# Altium schematic sheet bb_optocouplers2.SchDoc
size A4; SheetNumber: 5; SheetTotal: 6
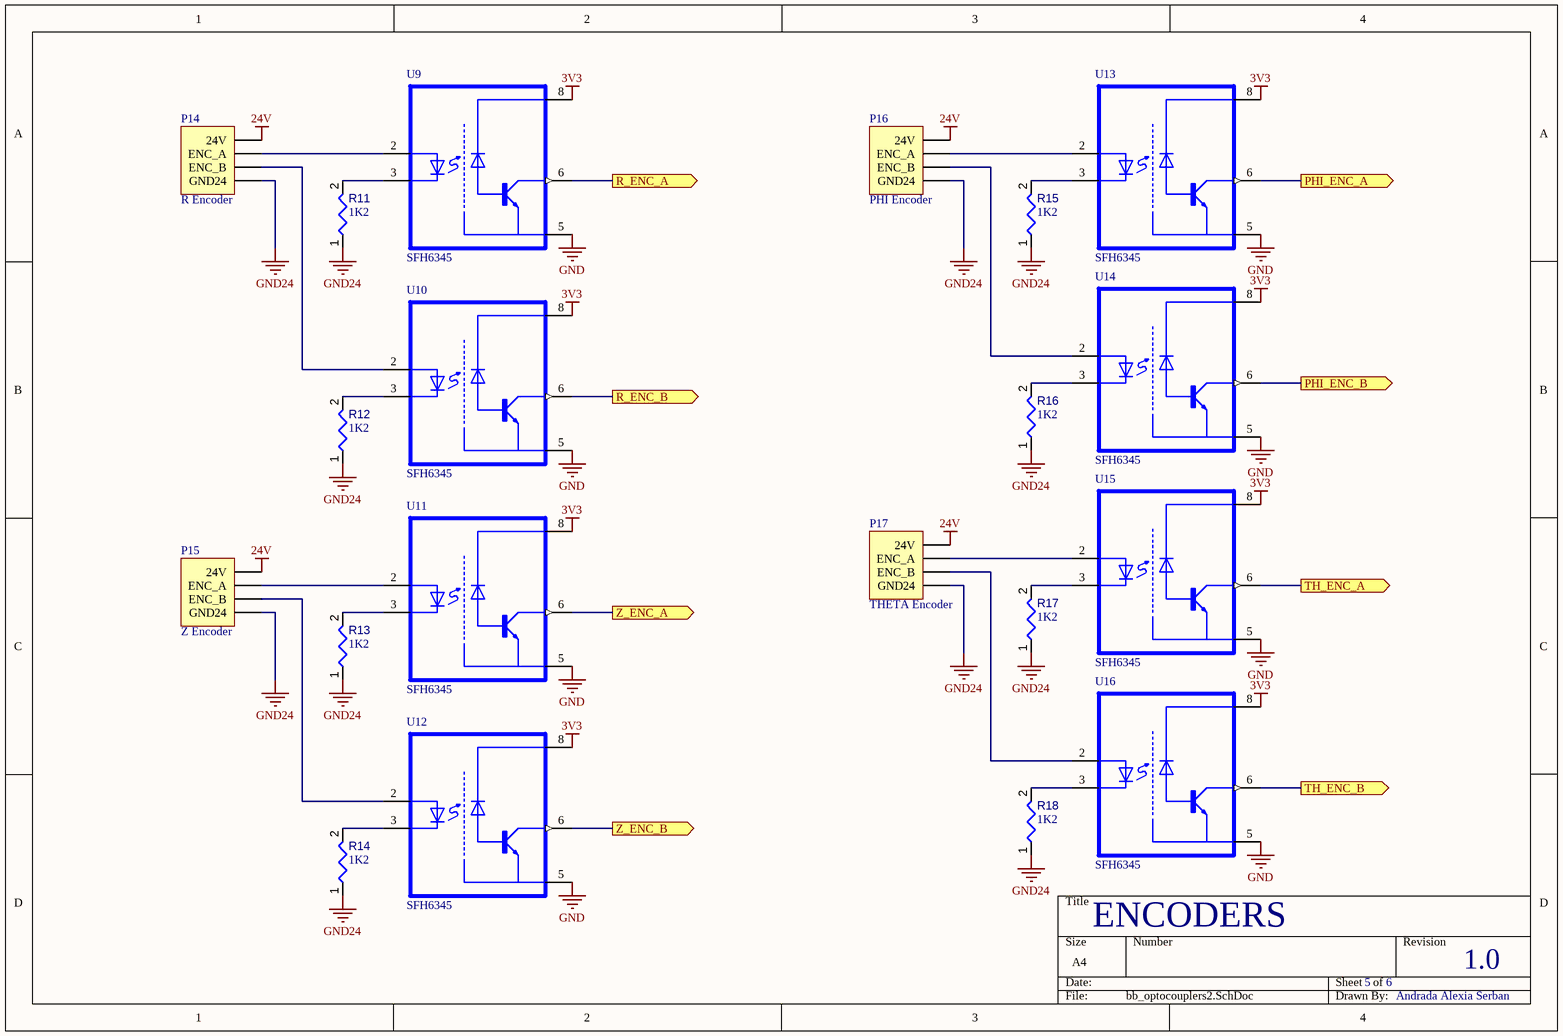
[diagram p0: bb_optocouplers2.SchDoc]

## Parts
P14  R Encoder  [FP_CONN4_TAP_254MM]
P15  Z Encoder  [FP_CONN4_TAP_254MM]
P16  PHI Encoder  [FP_CONN4_TAP_254MM]
P17  THETA Encoder  [FP_CONN4_TAP_254MM]
R11  value 1K2  [RESC0402(1005)_L]  (hidden comment: Resistor 200R +/-5 % 0402 63 mW)
R12  value 1K2  [RESC0402(1005)_L]  (hidden comment: Resistor 200R +/-5 % 0402 63 mW)
R13  value 1K2  [RESC0402(1005)_L]  (hidden comment: Resistor 200R +/-5 % 0402 63 mW)
R14  value 1K2  [RESC0402(1005)_L]  (hidden comment: Resistor 200R +/-5 % 0402 63 mW)
R15  value 1K2  [RESC0402(1005)_L]  (hidden comment: Resistor 200R +/-5 % 0402 63 mW)
R16  value 1K2  [RESC0402(1005)_L]  (hidden comment: Resistor 200R +/-5 % 0402 63 mW)
R17  value 1K2  [RESC0402(1005)_L]  (hidden comment: Resistor 200R +/-5 % 0402 63 mW)
R18  value 1K2  [RESC0402(1005)_L]  (hidden comment: Resistor 200R +/-5 % 0402 63 mW)
U9  SFH6345  [DIP762W50P254L977H451Q8]
U10  SFH6345  [DIP762W50P254L977H451Q8]
U11  SFH6345  [DIP762W50P254L977H451Q8]
U12  SFH6345  [DIP762W50P254L977H451Q8]
U13  SFH6345  [DIP762W50P254L977H451Q8]
U14  SFH6345  [DIP762W50P254L977H451Q8]
U15  SFH6345  [DIP762W50P254L977H451Q8]
U16  SFH6345  [DIP762W50P254L977H451Q8]

## Ports
PHI_ENC_A (out, see bb_Nucleo[3B]), PHI_ENC_B (out, see bb_Nucleo[3C]), R_ENC_A (out, see bb_Nucleo[3B]), R_ENC_B (out, see bb_Nucleo[3B]), TH_ENC_A (out, see bb_Nucleo[2B]), TH_ENC_B (out, see bb_Nucleo[2B]), Z_ENC_A (out, see bb_Nucleo[1B]), Z_ENC_B (out, see bb_Nucleo[1C])

## Nets
3V3: U9.8(VCC) U10.8(VCC) U11.8(VCC) U12.8(VCC) U13.8(VCC) U14.8(VCC) U15.8(VCC) U16.8(VCC)
24V: P14.4(24V) P15.4(24V) P16.4(24V) P17.4(24V)
GND: U9.5(E) U10.5(E) U11.5(E) U12.5(E) U13.5(E) U14.5(E) U15.5(E) U16.5(E)
GND24: P14.1(GND24) P15.1(GND24) P16.1(GND24) P17.1(GND24) R11.1 R12.1 R13.1 R14.1 R15.1 R16.1 R17.1 R18.1
PHI_ENC_A: U13.6(CO) ; port PHI_ENC_A
PHI_ENC_B: U14.6(CO) ; port PHI_ENC_B
R_ENC_A: U9.6(CO) ; port R_ENC_A
R_ENC_B: U10.6(CO) ; port R_ENC_B
TH_ENC_A: U15.6(CO) ; port TH_ENC_A
TH_ENC_B: U16.6(CO) ; port TH_ENC_B
Z_ENC_A: U11.6(CO) ; port Z_ENC_A
Z_ENC_B: U12.6(CO) ; port Z_ENC_B
NetP14_2: P14.2(ENC_B) U10.2(A)
NetP14_3: P14.3(ENC_A) U9.2(A)
NetP15_2: P15.2(ENC_B) U12.2(A)
NetP15_3: P15.3(ENC_A) U11.2(A)
NetP16_2: P16.2(ENC_B) U14.2(A)
NetP16_3: P16.3(ENC_A) U13.2(A)
NetP17_2: P17.2(ENC_B) U16.2(A)
NetP17_3: P17.3(ENC_A) U15.2(A)
NetR11_2: R11.2 U9.3(C)
NetR12_2: R12.2 U10.3(C)
NetR13_2: R13.2 U11.3(C)
NetR14_2: R14.2 U12.3(C)
NetR15_2: R15.2 U13.3(C)
NetR16_2: R16.2 U14.3(C)
NetR17_2: R17.2 U15.3(C)
NetR18_2: R18.2 U16.3(C)

## Notes on the sheet
- ENCODERS
- 5
- 6
- 1.0
- Andrada Alexia Serban

## Library data of the parts
P14-P17 = Connector_4pin: 4pin Connector
R11-R18 = CMP-009-00161-3: Chip Resistor, 200 Ohms, +/-5 %, 63 mW, -55 to 155 degC, 0402; Power: 63mW; Tolerance: 5%; Min Operating Temperature: -55°C; Case/Package: 0402; Max Operating Temperature: 155°C; Pins: 2
U9-U16 = CMP-013-000000-1: Analog High Speed Coupler, High Noise Immunity, 1 MBd, 15 kV/ÎĽs; Pin Count: 5; Source: SFH6345.SchLib; MP: SFH6345; Design Item ID: SFH6345; Price: None; Availability: Unavailable; Component Type: Standard; Package: None; Value: *